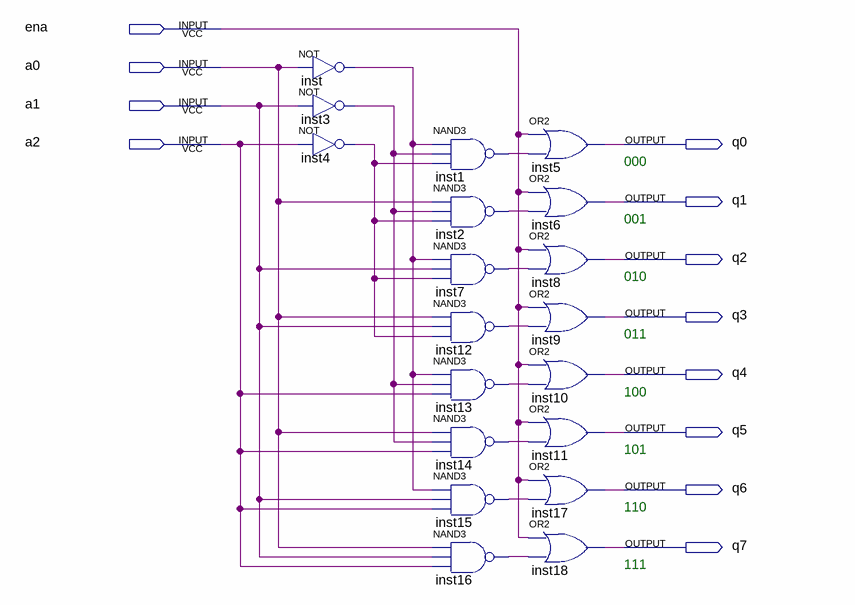
[diagram p0: schematic sheet]
// Quartus schematic dc3g.bdf as structural Verilog: 19 symbols, 12 pins
module dc3g (
  input  ena,
  input  a0,
  input  a1,
  input  a2,
  output q0,
  output q1,
  output q2,
  output q3,
  output q4,
  output q5,
  output q6,
  output q7
);

  wire inst1_out, inst2_out, inst3_out, inst4_out, inst7_out, inst12_out, inst13_out, inst14_out, inst15_out,
       inst16_out, inst_out;

  not inst (inst_out, a0);
  not inst3 (inst3_out, a1);
  not inst4 (inst4_out, a2);
  nand inst1 (inst1_out, inst_out, inst3_out, inst4_out);
  nand inst2 (inst2_out, a0, inst3_out, inst4_out);
  nand inst7 (inst7_out, inst_out, a1, inst4_out);
  nand inst12 (inst12_out, a0, a1, inst4_out);
  nand inst13 (inst13_out, inst_out, inst3_out, a2);
  nand inst14 (inst14_out, a0, inst3_out, a2);
  nand inst15 (inst15_out, inst_out, a1, a2);
  nand inst16 (inst16_out, a0, a1, a2);
  or inst5 (q0, ena, inst1_out);
  or inst6 (q1, ena, inst2_out);
  or inst8 (q2, ena, inst7_out);
  or inst9 (q3, ena, inst12_out);
  or inst10 (q4, ena, inst13_out);
  or inst11 (q5, ena, inst14_out);
  or inst17 (q6, ena, inst15_out);
  or inst18 (q7, ena, inst16_out);

  // Notes on the sheet:
  //   000
  //   001
  //   010
  //   011
  //   100
  //   101
  //   110
  //   111
endmodule
